# Altium schematic sheet main board_CHM.SchDoc
size A3; PageSetup: Record=PageOptions|CenterHorizontal=True|CenterVertical=True|PrintScale=1.03|XCorrection=1.00|YCorrection=1.00|PrintKind=1|BorderSize=5000000|LeftOffset=0|BottomOffset=0|Orientation=2|PaperLength=1000|PaperWidth=1000|Scale=100|PaperSource=15|PrintQuality=600|MediaType=1|DitherType=10|PaperKind=A3|PrintScaleMode=1
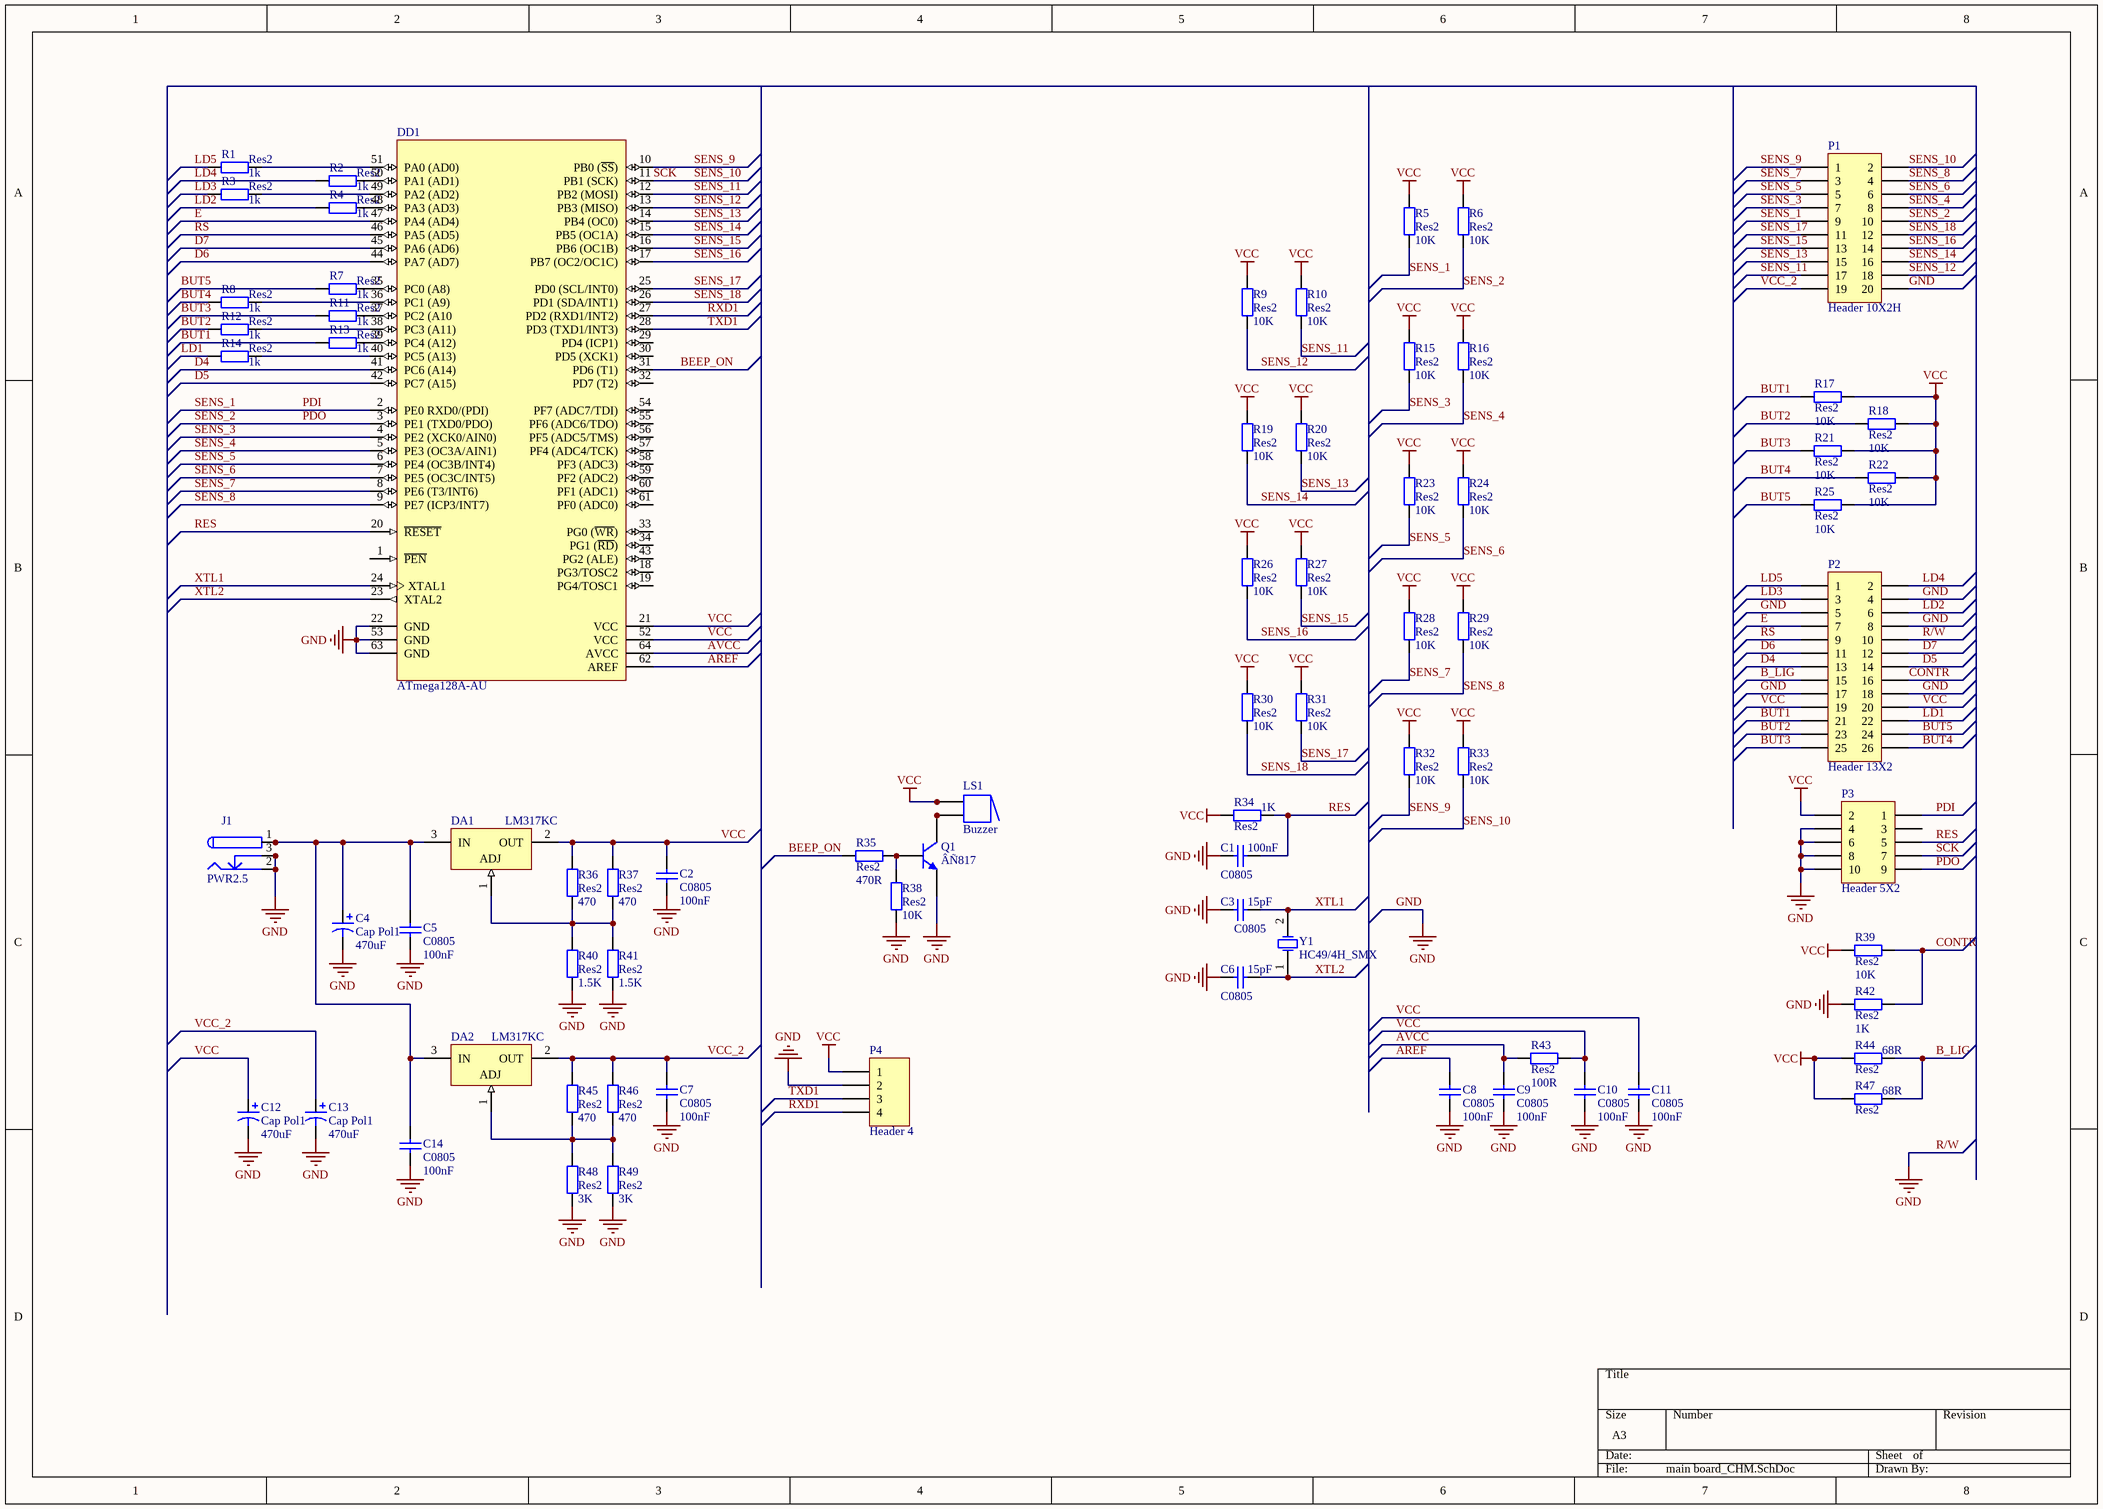
[diagram p0: main board_CHM.SchDoc]

## Parts
C1  C0805  value 100nF  [0805]
C2  C0805  value 100nF  [0805]
C3  C0805  value 15pF  [0805]
C4  Cap Pol1  value 470uF  [RB5-10.5]
C5  C0805  value 100nF  [0805]
C6  C0805  value 15pF  [0805]
C7  C0805  value 100nF  [0805]
C8  C0805  value 100nF  [0805]
C9  C0805  value 100nF  [0805]
C10  C0805  value 100nF  [0805]
C11  C0805  value 100nF  [0805]
C12  Cap Pol1  value 470uF  [RB5-10.5]
C13  Cap Pol1  value 470uF  [RB5-10.5]
C14  C0805  value 100nF  [0805]
DA1  LM317KC  [KC03]
DA2  LM317KC  [KC03]
DD1  ATmega128A-AU  [64A_N]
J1  PWR2.5  [KLD-0202]
LS1  Buzzer  [ABSM-1574]
P1  Header 10X2H  [HDR2X10H]
P2  Header 13X2  [HDR2X13]
P3  Header 5X2  [HDR2X5]
P4  Header 4  [HDR1X4]
Q1  ÂÑ817  [SOT23_M]
R1  Res2  value 1k  [6-0805_N]
R2  Res2  value 1k  [6-0805_N]
R3  Res2  value 1k  [6-0805_N]
R4  Res2  value 1k  [6-0805_N]
R5  Res2  value 10K  [6-0805_N]
R6  Res2  value 10K  [6-0805_N]
R7  Res2  value 1k  [6-0805_N]
R8  Res2  value 1k  [6-0805_N]
R9  Res2  value 10K  [6-0805_N]
R10  Res2  value 10K  [6-0805_N]
R11  Res2  value 1k  [6-0805_N]
R12  Res2  value 1k  [6-0805_N]
R13  Res2  value 1k  [6-0805_N]
R14  Res2  value 1k  [6-0805_N]
R15  Res2  value 10K  [6-0805_N]
R16  Res2  value 10K  [6-0805_N]
R17  Res2  value 10K  [6-0805_N]
R18  Res2  value 10K  [6-0805_N]
R19  Res2  value 10K  [6-0805_N]
R20  Res2  value 10K  [6-0805_N]
R21  Res2  value 10K  [6-0805_N]
R22  Res2  value 10K  [6-0805_N]
R23  Res2  value 10K  [6-0805_N]
R24  Res2  value 10K  [6-0805_N]
R25  Res2  value 10K  [6-0805_N]
R26  Res2  value 10K  [6-0805_N]
R27  Res2  value 10K  [6-0805_N]
R28  Res2  value 10K  [6-0805_N]
R29  Res2  value 10K  [6-0805_N]
R30  Res2  value 10K  [6-0805_N]
R31  Res2  value 10K  [6-0805_N]
R32  Res2  value 10K  [6-0805_N]
R33  Res2  value 10K  [6-0805_N]
R34  Res2  value 1K  [6-0805_N]
R35  Res2  value 470R  [6-0805_N]
R36  Res2  value 470  [6-0805_N]
R37  Res2  value 470  [6-0805_N]
R38  Res2  value 10K  [6-0805_N]
R39  Res2  value 10K  [6-0805_N]
R40  Res2  value 1.5K  [6-0805_N]
R41  Res2  value 1.5K  [6-0805_N]
R42  Res2  value 1K  [6-0805_N]
R43  Res2  value 100R  [6-0805_N]
R44  Res2  value 68R  [6-0805_N]
R45  Res2  value 470  [6-0805_N]
R46  Res2  value 470  [6-0805_N]
R47  Res2  value 68R  [6-0805_N]
R48  Res2  value 3K  [6-0805_N]
R49  Res2  value 3K  [6-0805_N]
Y1  HC49/4H_SMX  [HC49/4H_SMX]

## Nets
GND: C1.1 C2.1 C3.1 C4.2 C5.1 C6.1 C7.1 C8.1 C9.1 C10.1 C11.1 C12.2 C13.2 C14.1 DD1.22(GND) DD1.53(GND) DD1.63(GND) J1.2 J1.2A J1.2B J1.3 J1.3A J1.3B P1.20 P2.4 P2.5 P2.8 P2.10 P2.17 P2.18 P3.4 P3.6 P3.8 P3.10 P4.2 Q1.3(E) R38.1 R40.1 R41.1 R42.1 R48.1 R49.1  [also labelled R/W]
VCC: C2.2 C10.2 C11.2 C12.1 DA1.2(OUT) DD1.21(VCC) DD1.52(VCC) LS1.1 LS1.1A P2.19 P2.20 P3.2 P4.1 R5.2 R6.2 R9.2 R10.2 R15.2 R16.2 R17.2 R18.2 R19.2 R20.2 R21.2 R22.2 R23.2 R24.2 R25.2 R26.2 R27.2 R28.2 R29.2 R30.2 R31.2 R32.2 R33.2 R34.1 R36.2 R37.2 R39.1 R43.2 R44.1 R47.1
AREF: C8.2 DD1.62(AREF)
AVCC: C9.2 DD1.64(AVCC) R43.1
B_LIG: P2.15 R44.2 R47.2
BEEP_ON: DD1.31(PD6_(T1)) R35.1
BUT1: P2.21 R13.1 R17.1
BUT2: P2.23 R12.1 R18.1
BUT3: P2.25 R11.1 R21.1
BUT4: P2.26 R8.1 R22.1
BUT5: P2.24 R7.1 R25.1
CONTR: P2.16 R39.2 R42.2
D4: DD1.41(PC6_(A14)) P2.13
D5: DD1.42(PC7_(A15)) P2.14
D6: DD1.44(PA7_(AD7)) P2.11
D7: DD1.45(PA6_(AD6)) P2.12
E: DD1.47(PA4_(AD4)) P2.7
LD1: P2.22 R14.1
LD2: P2.6 R4.1
LD3: P2.3 R3.1
LD4: P2.2 R2.1
LD5: P2.1 R1.1
PDI: DD1.2(PE0_RXD0/(PDI)) P1.9 P3.1 R5.1  [also labelled SENS_1]
PDO: DD1.3(PE1_(TXD0/PDO)) P1.10 P3.9 R6.1  [also labelled SENS_2]
RES: C1.2 DD1.20(~{RESET}) P3.5 R34.2
RS: DD1.46(PA5_(AD5)) P2.9
RXD1: DD1.27(PD2_(RXD1/INT2)) P4.4
SCK: DD1.11(PB1_(SCK)) P1.2 P3.7 R33.1  [also labelled SENS_10]
SENS_3: DD1.4(PE2_(XCK0/AIN0)) P1.7 R15.1
SENS_4: DD1.5(PE3_(OC3A/AIN1)) P1.8 R16.1
SENS_5: DD1.6(PE4_(OC3B/INT4)) P1.5 R23.1
SENS_6: DD1.7(PE5_(OC3C/INT5)) P1.6 R24.1
SENS_7: DD1.8(PE6_(T3/INT6)) P1.3 R28.1
SENS_8: DD1.9(PE7_(ICP3/INT7)) P1.4 R29.1
SENS_9: DD1.10(PB0_(~{SS})) P1.1 R32.1
SENS_11: DD1.12(PB2_(MOSI)) P1.17 R10.1
SENS_12: DD1.13(PB3_(MISO)) P1.18 R9.1
SENS_13: DD1.14(PB4_(OC0)) P1.15 R20.1
SENS_14: DD1.15(PB5_(OC1A)) P1.16 R19.1
SENS_15: DD1.16(PB6_(OC1B)) P1.13 R27.1
SENS_16: DD1.17(PB7_(OC2/OC1C)) P1.14 R26.1
SENS_17: DD1.25(PD0_(SCL/INT0)) P1.11 R31.1
SENS_18: DD1.26(PD1_(SDA/INT1)) P1.12 R30.1
TXD1: DD1.28(PD3_(TXD1/INT3)) P4.3
VCC_2: C7.2 C13.1 DA2.2(OUT) P1.19 R45.2 R46.2
XTL1: C3.2 DD1.24(XTAL1) Y1.2(OSC2)
XTL2: C6.2 DD1.23(XTAL2) Y1.1(OSC1)
NetC4_1: C4.1 C5.2 C14.2 DA1.3(IN) DA2.3(IN) J1.1 J1.1A J1.1B
NetDA1_1: DA1.1(ADJ) R36.1 R37.1 R40.2 R41.2
NetDA2_1: DA2.1(ADJ) R45.1 R46.1 R48.2 R49.2
NetDD1_35: DD1.35(PC0_(A8)) R7.2
NetDD1_36: DD1.36(PC1_(A9)) R8.2
NetDD1_37: DD1.37(PC2_(A10) R11.2
NetDD1_38: DD1.38(PC3_(A11)) R12.2
NetDD1_39: DD1.39(PC4_(A12)) R13.2
NetDD1_40: DD1.40(PC5_(A13)) R14.2
NetDD1_48: DD1.48(PA3_(AD3)) R4.2
NetDD1_49: DD1.49(PA2_(AD2)) R3.2
NetDD1_50: DD1.50(PA1_(AD1)) R2.2
NetDD1_51: DD1.51(PA0_(AD0)) R1.2
NetLS1_2: LS1.2 LS1.2A Q1.1(C)
NetQ1_2: Q1.2(B) R35.2 R38.2

Not connected (* = marked no-connect by the designer): DD1 1(~{PEN}) 18(PG3/TOSC2) 19(PG4/TOSC1) 29(PD4_(ICP1)) 30(PD5_(XCK1)) 32(PD7_(T2)) 33(PG0_(~{WR})) 34(PG1_(~{RD})) 43(PG2_(ALE)) 54(PF7_(ADC7/TDI)) 55(PF6_(ADC6/TDO)) 56(PF5_(ADC5/TMS)) 57(PF4_(ADC4/TCK)) 58(PF3_(ADC3)) 59(PF2_(ADC2)) 60(PF1_(ADC1)) 61(PF0_(ADC0)); P3 3

## Library data of the parts
C1-C3 C5-C11 C14 = C0805: Ceramic Chip Capacitor - Standard; Note: Footprint corresponds to dimensions for bulk cassette packaging. This case size has tightened tolerances.; Published: 17-Jul-2002; LatestRevisionDate: 19-Mar-2004; LatestRevisionNote: Silkscreen size reduced.; DatasheetDocument: Mar-2001; PackageDocument: Mar-2001; PackageReference: 0805; Publisher: Altium Limited; Code_JEITA: 0805; Code_IPC: 2012[0805]; ComponentLink1Description: Manufacturer Link; ComponentLink1URL: http://www.kemet.com/; ComponentLink2Description: Datasheet; ComponentLink2URL: http://www.kemet.com/kemet/web/homepage/kechome.nsf/vapubfilesname/F3102TA.pdf/$file/F3102TA.pdf
C4 C12 C13 = Cap Pol1: Polarized Capacitor (Radial); Published: 8-Jun-2000; LatestRevisionDate: 17-Jul-2002; LatestRevisionNote: Re-released for DXP Platform.; PackageReference: RB7.6-15; Publisher: Altium Limited; PackageDescription: Polarized Capacitor (Radial); 2 Leads
DA1 DA2 = LM317KC: 3-Terminal Adjustable Regulator; Note: Pin 2 is electrically connected to tab; Published: 15-Apr-2002; DatasheetVersion: Feb-1988; PackageVersion: Sep-1995; PackageReference: KC03; Publisher: Altium Limited; PackageDescription: TO, Thru-Hole, Vertical, Heatsink Mounted; 3 In-Line Leads; Pitch 2.54 mm; ComponentLink1Description: Manufacturer Link; ComponentLink1URL: http://www.ti.com/
DD1 = ATmega128A-AU: 8-bit AVR Microcontroller, 128KB Flash, 4KB EEPROM, 4KB SRAM, 64-pin TQFP, Industrial Grade (-40°C to 85°C); Published: 1-Apr-2010; DatasheetVersion: revE, Feb-2010; PackageVersion: revB, Oct-2001; PackageReference: 64A; Publisher: Altium Limited; PackageDescription: 64-Pin Plastic Thin Profile Quad Flat Pack, 14 x 14 x 1.0 mm Body, 0.8 mm Pitch (TQFP); Supplier 1: Digi-Key; Supplier Part Number 1: ATMEGA128A-AU-ND; Supplier 2: Farnell; Supplier Part Number 2: 1773397; Supplier 3: Mouser; Supplier Part Number 3: 556-ATMEGA128A-AU; Code_JEDEC: MS-026-AEB; ComponentLink1Description: Manufacturer Link; ComponentLink1URL: http://www.atmel.com/products/avr/default.asp?; ComponentLink2Description: ATmega128A Datasheet; ComponentLink2URL: http://www.atmel.com/dyn/resources/prod_documents/doc8151.pdf; ComponentLink3Description: ATmega128A Summary; ComponentLink3URL: http://www.atmel.com/dyn/resources/prod_documents/8151S.pdf; ComponentLink4Description: Atmel.com Home; ComponentLink4URL: http://www.atmel.com
J1 = PWR2.5: Low Voltage Power Supply Connector; Published: 17-Dec-2003; DatasheetDocument: 09-May-2002; Publisher: Altium Limited; ComponentLink1Description: Manufacturer Link; ComponentLink1URL: http://domino.kycon.com/internet/Products.html
LS1 = Buzzer: Magnetic Transducer Buzzer; Published: 24-Mar-1999; LatestRevisionDate: 17-Dec-2003; LatestRevisionNote: Schematic revised, PCB Footprint replaced.; DatasheetVersion: 17-Dec-2003; PackageReference: ABSM-1574; Publisher: Altium Limited; PackageDescription: Magnetic Transducer Buzzer; ComponentLink1Description: Manufacturer Link; ComponentLink1URL: http://www.megastar.com/linecard/buzzmode/index.php
P1 = Header 10X2H: Header, 10-Pin, Dual row, Right Angle; LatestRevisionDate: 17-Jul-2002; LatestRevisionNote: Re-released for DXP Platform.; Publisher: Altium Limited
P2 = Header 13X2: Header, 13-Pin, Dual row; LatestRevisionDate: 17-Jul-2002; LatestRevisionNote: Re-released for DXP Platform.; Publisher: Altium Limited
P3 = Header 5X2: Header, 5-Pin, Dual row; LatestRevisionDate: 17-Jul-2002; LatestRevisionNote: Re-released for DXP Platform.; Publisher: Altium Limited
P4 = Header 4: Header, 4-Pin; LatestRevisionDate: 17-Jul-2002; LatestRevisionNote: Re-released for DXP Platform.; Publisher: Altium Limited
Q1 = QNPN: NPN Bipolar Transistor; pin to pad: 2>3 3>2; Published: 8-Jun-2000; LatestRevisionDate: 29-May-2009; LatestRevisionNote: IPC-7351 Footprint Added.; PackageVersion: Aug-1999; PackageReference: SOT-23B; Publisher: Altium Limited; PackageDescription: 3-Pin SOT-23 Package 0.95 mm Pitch, 2.4 mm Lead Span
R1-R49 = Res2: Resistor; Published: 8-Jun-2000; LatestRevisionDate: 17-Jul-2002; LatestRevisionNote: Re-released for DXP Platform.; PackageReference: AXIAL-0.4; Publisher: Altium Limited; PackageDescription: Axial Device, Thru-Hole; 2 Leads; 0.4 in Pin Spacing
Y1 = HC49/4H_SMX: Surface Mount Quartz Crystal; Note: PCB layout complies with manufacturer's recommendation.; Published: 17-Jul-2002; DatasheetDocument: 18-Oct-1999; PackageDocument: 18-Oct-1999; PackageReference: HC49/4H_SMX; Publisher: Altium Limited; ComponentLink1Description: Manufacturer Link; ComponentLink1URL: http://www.cmac.com/mt/; ComponentLink2Description: Datasheet; ComponentLink2URL: http://www.cmac.com/mt/databook/crystals/smd/hc49_4h_smx.pdf